# Altium schematic sheet ZYNQ-PS.SchDoc
size A3; SheetNumber: 2; SheetTotal: 9
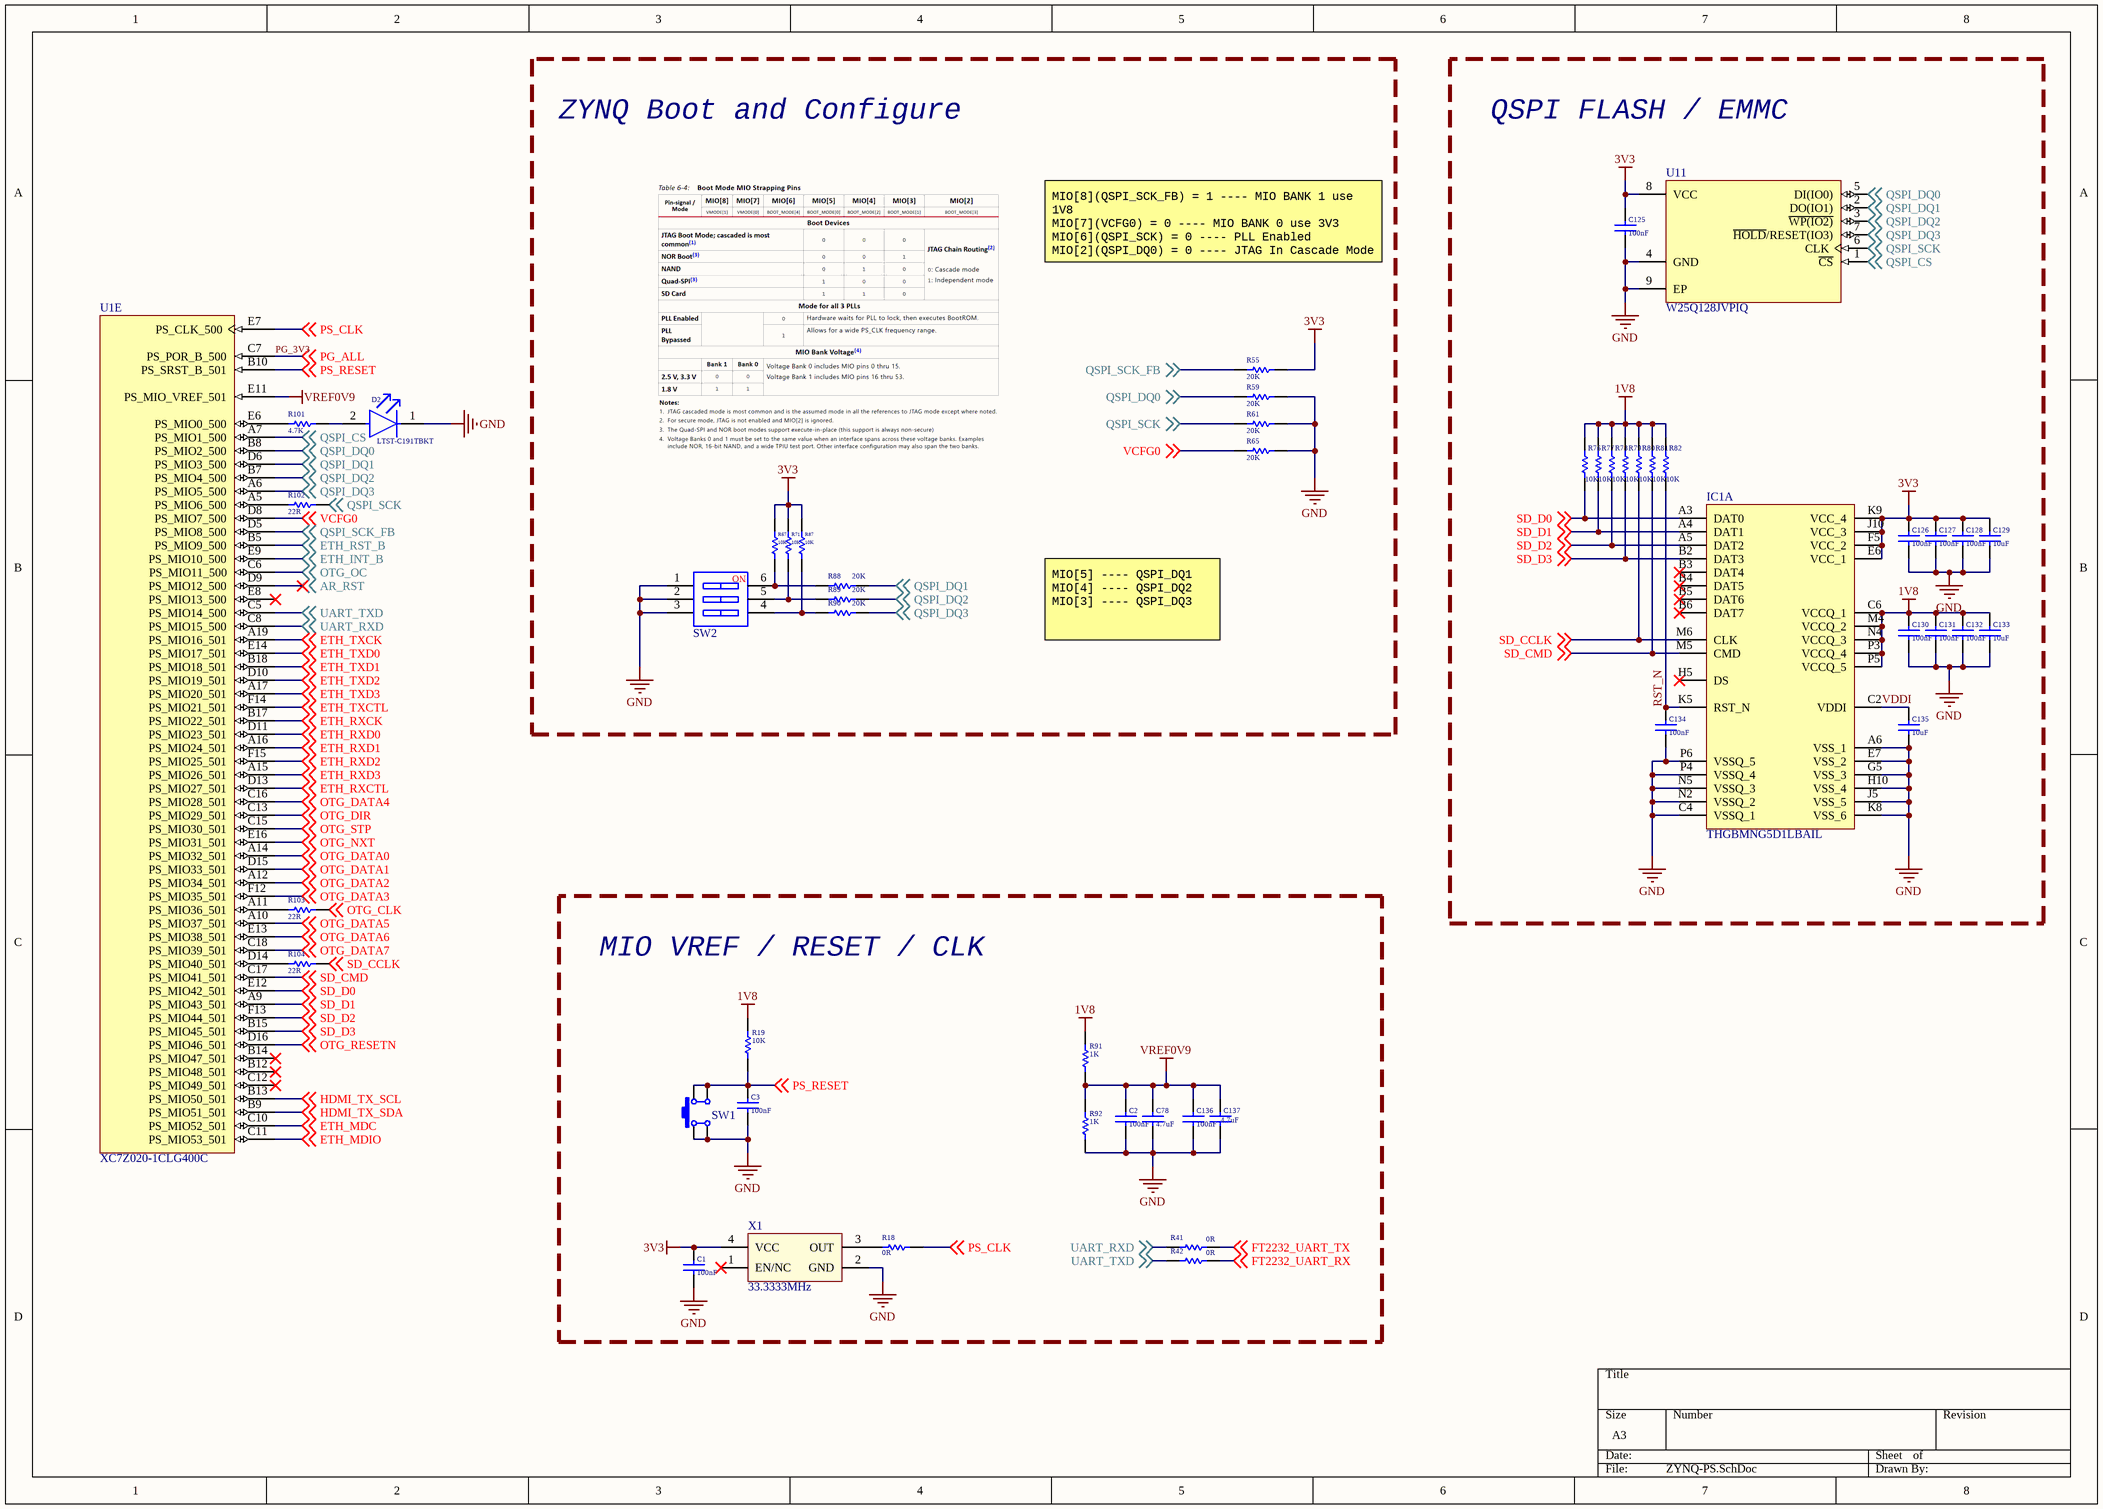
[diagram p0: ZYNQ-PS.SchDoc]

## Parts
C1  100nF  [CAPC1005X55X25LL05T10]
C2  100nF  [CAPC1005X55X25LL05T10]
C3  100nF  [CAPC1005X55X25LL05T10]
C78  4.7uF  [CAPC1005X55X25LL05T10]
C125  100nF  [CAPC1005X55X25LL05T10]
C126  100nF  [CAPC1005X55X25LL05T10]
C127  100nF  [CAPC1005X55X25LL05T10]
C128  100nF  [CAPC1005X55X25LL05T10]
C129  10uF  [CAPC1005X55X25LL05T10]
C130  100nF  [CAPC1005X55X25LL05T10]
C131  100nF  [CAPC1005X55X25LL05T10]
C132  100nF  [CAPC1005X55X25LL05T10]
C133  10uF  [CAPC1005X55X25LL05T10]
C134  100nF  [CAPC1005X55X25LL05T10]
C135  10uF  [CAPC1005X55X25LL05T10]
C136  100nF  [CAPC1005X55X25LL05T10]
C137  4.7uF  [CAPC1005X55X25LL05T10]
D2  LTST-C191TBKT  [FP-LTST-C191TBKT-MFG]
IC1  THGBMNG5D1LBAIL  [BGA153C50P14X14_1150X1300X80]  (part A of 2)
R18  0R  [RESC1005X40X25LL05T05]
R19  10K  [RESC1005X40X25LL05T05]
R41  0R  [RESC1005X40X25LL05T05]
R42  0R  [RESC1005X40X25LL05T05]
R55  20K  [RESC1005X40X25LL05T05]
R59  20K  [RESC1005X40X25LL05T05]
R61  20K  [RESC1005X40X25LL05T05]
R65  20K  [RESC1005X40X25LL05T05]
R67  10K  [RESC1005X40X25LL05T05]
R71  10K  [RESC1005X40X25LL05T05]
R76  10K  [RESC1005X40X25LL05T05]
R77  10K  [RESC1005X40X25LL05T05]
R78  10K  [RESC1005X40X25LL05T05]
R79  10K  [RESC1005X40X25LL05T05]
R80  10K  [RESC1005X40X25LL05T05]
R81  10K  [RESC1005X40X25LL05T05]
R82  10K  [RESC1005X40X25LL05T05]
R87  10K  [RESC1005X40X25LL05T05]
R88  20K  [RESC1005X40X25LL05T05]
R89  20K  [RESC1005X40X25LL05T05]
R90  20K  [RESC1005X40X25LL05T05]
R91  1K  [RESC1005X40X25LL05T05]
R92  1K  [RESC1005X40X25LL05T05]
R101  4.7K  [RESC1005X40X25LL05T05]
R102  22R  [RESC1005X40X25LL05T05]
R103  22R  [RESC1005X40X25LL05T05]
R104  22R  [RESC1005X40X25LL05T05]
SW1  3*4*2.5  [SW-SMD-4.2x3.2_4P]  (value not drawn)
SW2  DIP-SW-3P  [SW1.27 SMD-3P]  (value not drawn)
U1  XC7Z020-1CLG400C  [CLG400]  (part E of 9)
U11  W25Q128JVPIQ  [FP-ZP-IPC_C]
X1  33.3333MHz  [OSC-2025-4P]

## Blocks framed on the sheet
ZYNQ Boot and Configure: R55 R59 R61 R65 R67 R71 R87-R90 SW2
QSPI FLASH / EMMC: C125-C135 IC1 R76-R82 U11
MIO VREF / RESET / CLK: C1-C3 C78 C136 C137 R18 R19 R41 R42 R91 R92 SW1 X1

## Nets
1V8: C130.2 C131.2 C132.2 C133.2 IC1.C6(VCCQ_1) IC1.M4(VCCQ_2) IC1.N4(VCCQ_3) IC1.P3(VCCQ_4) IC1.P5(VCCQ_5) R19.2 R76.2 R77.2 R78.2 R79.2 R80.2 R81.2 R82.2 R91.2
3V3: C1.2 C125.2 C126.2 C127.2 C128.2 C129.2 IC1.E6(VCC_1) IC1.F5(VCC_2) IC1.J10(VCC_3) IC1.K9(VCC_4) R55.1 R67.1 R71.1 R87.1 U11.8(VCC) X1.4(VCC)
GND: C1.1 C2.1 C3.1 C78.1 C125.1 C126.1 C127.1 C128.1 C129.1 C130.1 C131.1 C132.1 C133.1 C134.1 C135.1 C136.1 C137.1 D2.1(C) IC1.A6(VSS_1) IC1.C4(VSSQ_1) IC1.E7(VSS_2) IC1.G5(VSS_3) IC1.H10(VSS_4) IC1.J5(VSS_5) IC1.K8(VSS_6) IC1.N2(VSSQ_2) IC1.N5(VSSQ_3) IC1.P4(VSSQ_4) IC1.P6(VSSQ_5) R59.1 R61.1 R65.1 R92.1 SW1.1 SW1.4 SW2.1 SW2.2 SW2.3 U11.4(GND) U11.9(EP) X1.2(GND)
VREF0V9: C2.2 C78.2 C136.2 C137.2 R91.1 R92.2 U1.E11(PS_MIO_VREF_501)
AR_RST: U1.D9(PS_MIO12_500) ; off-sheet AR_RST
ETH_INT_B: U1.E9(PS_MIO10_500) ; off-sheet ETH_INT_B
ETH_MDC: U1.C10(PS_MIO52_501) ; off-sheet ETH_MDC
ETH_MDIO: U1.C11(PS_MIO53_501) ; off-sheet ETH_MDIO
ETH_RST_B: U1.B5(PS_MIO9_500) ; off-sheet ETH_RST_B
ETH_RXCK: U1.B17(PS_MIO22_501) ; off-sheet ETH_RXCK
ETH_RXCTL: U1.D13(PS_MIO27_501) ; off-sheet ETH_RXCTL
ETH_RXD0: U1.D11(PS_MIO23_501) ; off-sheet ETH_RXD0
ETH_RXD1: U1.A16(PS_MIO24_501) ; off-sheet ETH_RXD1
ETH_RXD2: U1.F15(PS_MIO25_501) ; off-sheet ETH_RXD2
ETH_RXD3: U1.A15(PS_MIO26_501) ; off-sheet ETH_RXD3
ETH_TXCK: U1.A19(PS_MIO16_501) ; off-sheet ETH_TXCK
ETH_TXCTL: U1.F14(PS_MIO21_501) ; off-sheet ETH_TXCTL
ETH_TXD0: U1.E14(PS_MIO17_501) ; off-sheet ETH_TXD0
ETH_TXD1: U1.B18(PS_MIO18_501) ; off-sheet ETH_TXD1
ETH_TXD2: U1.D10(PS_MIO19_501) ; off-sheet ETH_TXD2
ETH_TXD3: U1.A17(PS_MIO20_501) ; off-sheet ETH_TXD3
FT2232_UART_RX: R42.1 ; off-sheet FT2232_UART_RX
FT2232_UART_TX: R41.1 ; off-sheet FT2232_UART_TX
HDMI_TX_SCL: U1.B13(PS_MIO50_501) ; off-sheet HDMI_TX_SCL
HDMI_TX_SDA: U1.B9(PS_MIO51_501) ; off-sheet HDMI_TX_SDA
OTG_CLK: R103.1 ; off-sheet OTG_CLK
OTG_DATA0: U1.A14(PS_MIO32_501) ; off-sheet OTG_DATA0
OTG_DATA1: U1.D15(PS_MIO33_501) ; off-sheet OTG_DATA1
OTG_DATA2: U1.A12(PS_MIO34_501) ; off-sheet OTG_DATA2
OTG_DATA3: U1.F12(PS_MIO35_501) ; off-sheet OTG_DATA3
OTG_DATA4: U1.C16(PS_MIO28_501) ; off-sheet OTG_DATA4
OTG_DATA5: U1.A10(PS_MIO37_501) ; off-sheet OTG_DATA5
OTG_DATA6: U1.E13(PS_MIO38_501) ; off-sheet OTG_DATA6
OTG_DATA7: U1.C18(PS_MIO39_501) ; off-sheet OTG_DATA7
OTG_DIR: U1.C13(PS_MIO29_501) ; off-sheet OTG_DIR
OTG_NXT: U1.E16(PS_MIO31_501) ; off-sheet OTG_NXT
OTG_OC: U1.C6(PS_MIO11_500) ; off-sheet OTG_OC
OTG_RESETN: U1.D16(PS_MIO46_501) ; off-sheet OTG_RESETN
OTG_STP: U1.C15(PS_MIO30_501) ; off-sheet OTG_STP
PG_3V3: U1.C7(PS_POR_B_500) ; off-sheet PG_ALL  [also labelled PG_ALL]
PS_CLK: R18.2 U1.E7(PS_CLK_500) ; off-sheet PS_CLK
PS_RESET: C3.2 R19.1 SW1.2 SW1.3 U1.B10(PS_SRST_B_501) ; off-sheet PS_RESET
QSPI_CS: U1.A7(PS_MIO1_500) U11.1(~{CS}) ; off-sheet QSPI_CS
QSPI_DQ0: R59.2 U1.B8(PS_MIO2_500) U11.5(DI(IO0)) ; off-sheet QSPI_DQ0
QSPI_DQ1: R88.1 U1.D6(PS_MIO3_500) U11.2(DO(IO1)) ; off-sheet QSPI_DQ1
QSPI_DQ2: R89.1 U1.B7(PS_MIO4_500) U11.3(~{WP(IO2)}) ; off-sheet QSPI_DQ2
QSPI_DQ3: R90.1 U1.A6(PS_MIO5_500) U11.7(~{HOLD}/RESET(IO3)) ; off-sheet QSPI_DQ3
QSPI_SCK: R61.2 R102.1 U11.6(CLK) ; off-sheet QSPI_SCK
QSPI_SCK_FB: R55.2 U1.D5(PS_MIO8_500) ; off-sheet QSPI_SCK_FB
RST_N: C134.2 IC1.K5(RST_N) R82.1
SD_CCLK: IC1.M6(CLK) R80.1 R104.1 ; off-sheet SD_CCLK
SD_CMD: IC1.M5(CMD) R81.1 U1.C17(PS_MIO41_501) ; off-sheet SD_CMD
SD_D0: IC1.A3(DAT0) R76.1 U1.E12(PS_MIO42_501) ; off-sheet SD_D0
SD_D1: IC1.A4(DAT1) R77.1 U1.A9(PS_MIO43_501) ; off-sheet SD_D1
SD_D2: IC1.A5(DAT2) R78.1 U1.F13(PS_MIO44_501) ; off-sheet SD_D2
SD_D3: IC1.B2(DAT3) R79.1 U1.B15(PS_MIO45_501) ; off-sheet SD_D3
UART_RXD: R41.2 U1.C8(PS_MIO15_500) ; off-sheet UART_RXD
UART_TXD: R42.2 U1.C5(PS_MIO14_500) ; off-sheet UART_TXD
VCFG0: R65.2 U1.D8(PS_MIO7_500) ; off-sheet VCFG0
VDDI: C135.2 IC1.C2(VDDI)
NetD2_2: D2.2(A) R101.1
NetR18_1: R18.1 X1.3(OUT)
NetR67_2: R67.2 R88.2 SW2.6
NetR71_2: R71.2 R89.2 SW2.5
NetR87_2: R87.2 R90.2 SW2.4
NetR101_2: R101.2 U1.E6(PS_MIO0_500)
NetR102_2: R102.2 U1.A5(PS_MIO6_500)
NetR103_2: R103.2 U1.A11(PS_MIO36_501)
NetR104_2: R104.2 U1.D14(PS_MIO40_501)

Not connected (* = marked no-connect by the designer): IC1 B3(DAT4)* B4(DAT5)* B5(DAT6)* B6(DAT7)* H5(DS)*; U1 B12(PS_MIO48_501)* B14(PS_MIO47_501)* C12(PS_MIO49_501)* E8(PS_MIO13_500)*; X1 1(EN/NC)*

## Notes on the sheet
- MIO[8](QSPI_SCK_FB) = 1 ---- MIO BANK 1 use 1V8
  MIO[7](VCFG0) = 0 ---- MIO BANK 0 use 3V3
  MIO[6](QSPI_SCK) = 0 ---- PLL Enabled
  MIO[2](QSPI_DQ0) = 0 ---- JTAG In Cascade Mode
- MIO[5] ---- QSPI_DQ1
  MIO[4] ---- QSPI_DQ2
  MIO[3] ---- QSPI_DQ3
- (in symbol DIP-SW-3P) NO

## Library data of the parts
C1-C3 C78 C125-C137 = CMP-2008-04639-1: Part Number: GRM155R71H104KE14D; Manufacturer: Murata
D2 = CMP-22017-000008-1: LED BLUE CLEAR CHIP SMD; Reverse Voltage: 5V; Dominant Wavelength: 475nm; Luminous Intensity: 180mcd; Number of LEDs: 1; Lens Color: Colorless; Lens Style: Diffused; Wavelength: 468nm; Forward Current: 20mA; Forward Voltage: 3.8V; Max Power Dissipation: 75mW; Viewing Angle: 130°; Power Dissipation: 76mW; Number of Pins: 2; Package Quantity: 1; Illumination Color: Blue; Lens Transparency: Clear; Max Operating Temperature: 80°C; Height: 0.55mm; Case Code (Imperial): 0603; Min Operating Temperature: -20°C; Width: 0.8mm; Test Current: 20mA; Depth: 1.6mm; Number of Elements: 1; Color: Blue; Lead Free: Lead Free; Packaging: Tape and Reel; Case Code (Metric): 1608; Radiation Hardening: No; Mount: Surface Mount; Length: 0.8mm; Case/Package: 0603
IC1 = THGBMNG5D1LBAIL: Integrated Circuit; Manufacturer_Name: Toshiba; Datasheet Link: https://datasheet.lcsc.com/szlcsc/1906131632_TOSHIBA-THGBMNG5D1LBAIL_C391255.pdf; Height: 0.8mm; Manufacturer_Part_Number: THGBMNG5D1LBAIL; Mouser Part Number: N/A; Mouser Price/Stock: https://www.mouser.co.uk/ProductDetail/Toshiba/THGBMNG5D1LBAIL?qs=Znm5pLBrcAKyiWgFGEjr8Q%3D%3D
R18 R19 R41 R42 R55 R59 R61 R65 R67 R71 R76-R82 R87-R92 R101-R104 = CMP-2002-00921-1: Manufacturer: Panasonic; Part Number: ERJ-2RKF40R2X
SW1 = SW SMD-3*4*2.5: 贴片4脚轻触开关; 联系下单店铺卖家 免费技术支持: 联系下单店铺卖家 免费帮你查找封装
SW2 = DIP-SW-3P: 3路拨码开关; 联系下单店铺卖家 免费技术支持: 联系下单店铺卖家 免费帮你查找封装; BOM名称: 3路拨码开关
U1 = CMP-0363-00002-3: 667 MHz Zynq™-7000 AP SoC, 130 PS I/O, 125 FPGA I/O, 400-Ball BGA, Speed Grade 1, Commercial Grade, Pb-Free; Flip Flops: 106400; Speed Grade: -1; LUTs: 53200; Extensible Block RAM (# 36Kb Blocks): 560 KB (140); PackageVersion: Rev 1.1, 09/2012; ComponentLink1Description: Datasheet; ComponentLink2Description: Package Specification; ComponentLink6Description: PCB and Layout Guide; PackageDescription: Wire-Bond Chip-Scale BGA, Body 17 x 17 mm, 0.8 mm Pitch; RoHS: Pb-Free; DatasheetVersion: v1.2; Mounting Technology: Surface Mount; ComponentLink5Description: Packaging and Pinout; ComponentLink5URL: http://www.xilinx.com/support/documentation/user_guides/ug865-Zynq-7000-Pkg-Pinout.pdf; ComponentLink6URL: http://www.xilinx.com/support/documentation/user_guides/ug483_7Series_PCB.pdf; Generic Part Number: XC7Z020; ComponentLink3Description: DC and AC Switching Characteristics; ComponentLink2URL: http://www.xilinx.com/support/documentation/user_guides/ug865-Zynq-7000-Pkg-Pinout.pdf; ComponentLink4Description: Package File; ComponentLink1URL: http://www.xilinx.com/support/documentation/data_sheets/ds190-Zynq-7000-Overview.pdf; PackageReference: CLG400; ComponentLink3URL: http://www.xilinx.com/support/documentation/data_sheets/ds187-XC7Z010-XC7Z020-Data-Sheet.pdf; PartNumber: XC7Z020-1CLG400C; ComponentLink4URL: http://www.xilinx.com/support/packagefiles/z7packages/xc7z020clg400pkg.txt; Code_JEDEC: MO-275-MMAA-1
U11 = CMP-00084-1: NOR Flash Serial (SPI, Dual SPI, Quad SPI) 3V/3.3V 128M-bit 16M x 8 6ns 8-Pin WSON EP T/R/Tray/Tube; Memory Format: Non-Volatile,FLASH; Frequency: 133MHz; Memory Size: 128Mb; Mounting Technology: Surface Mount; Packaging: Rail/Tube; Series: SpiFlash®; Max Operating Temperature: 85°C; RoHS Compliant: Yes; Min Operating Temperature: -40°C
X1 = XTAL-ACT-4P: 4脚有源晶振(振荡器); 联系下单店铺卖家 免费帮你查找封装: 联系下单店铺卖家 免费技术支持; BOM名称: 有源晶振(振荡器)